# EAGLE design Black_jr5 (EAGLE 7.6.0)
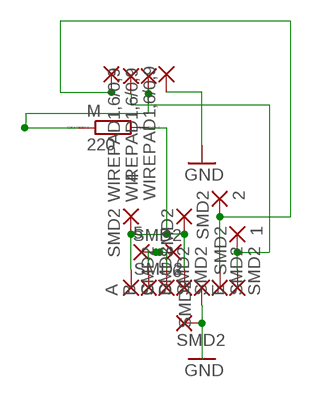
[diagram p0: schematic, sheet 1]

## Parts
1  SMD2  [SMD1,27-2,54]
2  SMD2  [SMD1,27-2,54]
4  SMD2  [SMD1,27-2,54]
5  SMD2  [SMD1,27-2,54]
6  SMD2  [SMD1,27-2,54]
+  SMD2  [SMD1,27-2,54]
-  SMD2  [SMD1,27-2,54]
--  1,6/0,9  [1,6/0,9]
---  WIREPAD1,6/0,9  [1,6/0,9]
----  WIREPAD1,6/0,9  [1,6/0,9]
-----  WIREPAD1,6/0,9  [1,6/0,9]
...  SMD2  [SMD1,27-2,54]
A  SMD2  [SMD1,27-2,54]
B  SMD2  [SMD1,27-2,54]
C  SMD2  [SMD1,27-2,54]
D  SMD2  [SMD1,27-2,54]
E  SMD2  [SMD1,27-2,54]
M  220  R0204/7  [0204/7]
PAD7  SMD2  [SMD1,27-2,54]

## Nets
GND: -----.1(P) -.1(P) PAD7.1(P)
N$2: ----.1(P) M.1
N$3: 4.1(P) ....1(P) A.1(P) D.1(P) M.2
N$4: 5.1(P) 6.1(P) B.1(P) C.1(P)
N$5: 2.1(P) +.1(P) --.1(P)
N$6: 1.1(P) ---.1(P) E.1(P)

## Library data of the parts
1 2 4-6 + - ... A B C D E PAD7 = wirepad:SMD2: SMD PAD
-- = wirepad:1,6/0,9: THROUGH-HOLE PAD
--- ---- ----- = wirepad:WIREPAD: Wire PAD connect wire on PCB
M = eagle-ltspice:R: RESISTOR, European symbol; SPICEMODEL: NONE; SPICEPREFIX: R

## Board
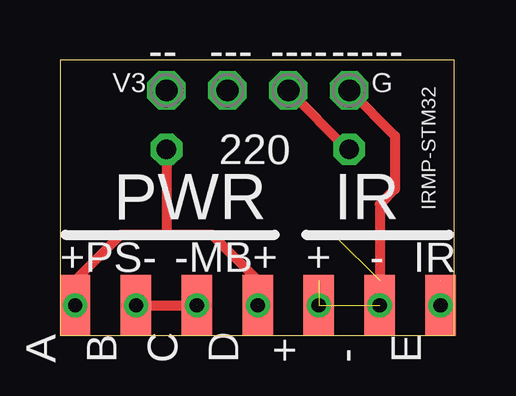
[diagram p1: board, top side]
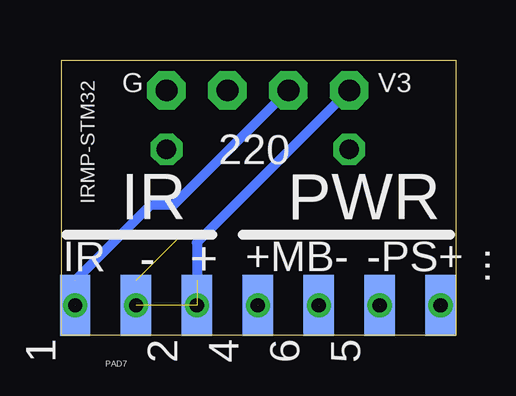
[diagram p2: board, bottom side, seen from below]

Size 16.45 x 11.48 mm. Coordinates in mm from the lower left corner, seen from the top.
Outline: 0,0 16.45,0 16.45,11.48 0,11.48 0,0
Copper layers (1*16): Top 0.035mm / dielectric 1.5mm / Bottom 0.035mm
Design rules "default *": minimum track width 10mil, minimum drill 24mil, track to track 8mil, track to pad 8mil, pad to pad 8mil, via to via 8mil, smd to smd 8mil, copper to edge 0mil, drill to drill 8mil, minimum pad ring 10mil, minimum via ring 8mil, stop-mask expansion 4mil, vias tented up to drill 0mil, thermal gap 10mil

### Footprints (pad centres in the part's own frame; a part is rotated, then mirrored left to right if it is on the bottom)
SMD1,27-2,54 = smd 1.27 x 2.54: 1 0,0
1,6/0,9 = drill 0.914 pad 1.6 octagon: 1 0,0
0204/7 = drill 0.813 octagon: 1 -3.81,0; 2 3.81,0

### Placement (x,y rotation side)
1  15.88,1.25 0 bottom
2  10.79,1.25 0 bottom
4  8.26,1.25 0 bottom
5  3.18,1.25 0 bottom
6  5.71,1.25 0 bottom
+  10.79,1.25 0 top
-  13.34,1.25 0 top
--  4.45,10.21 0 top
---  6.99,10.21 0 top
----  9.53,10.21 0 top
-----  12.07,10.21 0 top
...  0.64,1.25 180 bottom
A  0.64,1.25 0 top
B  3.18,1.25 0 top
C  5.71,1.25 0 top
D  8.26,1.25 0 top
E  15.88,1.25 0 top
M  8.26,7.75 180 top
PAD7  13.34,1.25 0 bottom

### Tracks (layer width: path | path; a pad name or v marks a point on that pad's centre or on a via)
GND  (1 unrouted)
  Top 0.406: -----.1 13.97,8.3 13.97,6.08 13.34,5.45 PAD7.1
N$2
  Top 0.406: ----.1 11.99,7.75 M.1
N$3  (via drill 0.6)  (2 unrouted)
  Top 0.406: ....1 v0.64,1.24 0.64,2.27 2.54,4.18 4.45,4.18 | 4.1 v8.26,1.24 8.26,2.27 6.35,4.18 4.45,4.18 | M.2 4.45,4.18
N$4  (2 unrouted)
  Top 0.406: 5.1 6.1
N$5  (via drill 0.6)  (6 unrouted)
  Top 0.406: v13.34,1.24 13.34,2.27
  Bottom 0.406: --.1 10.79,3.86 10.79,2.27
N$6  (via drill 0.6)  (2 unrouted)
  Top 0.406: 15.88,2.27 v15.88,1.24 1.1
  Bottom 0.406: 15.88,2.27 12.7,5.45 11.75,5.45 ---.1
N$8  (via drill 0.6)
  other vias: 3.18,1.24
N$9  (via drill 0.6)
  other vias: 5.71,1.24
N$10  (via drill 0.6)
  other vias: 10.79,1.24

### Text on the board
tNames: V3 | G | 220 | PWR | IR | IRMP-STM32 | +PS- | -MB+ | + | - | IR
bNames: V3 | G | IRMP-STM32 | 220 | PWR | IR | -PS+ | +MB- | + | - | IR